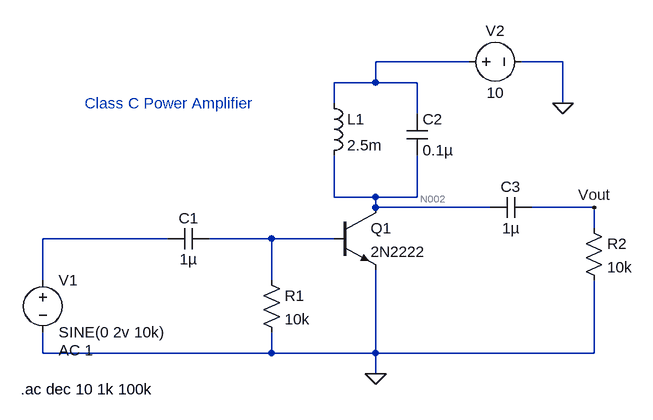
[diagram p0: schematic Experiment 5 - Class C Power Amplifiers.asc]
Experiment 5 - Class C Power Amplifiers.asc, the LTspice schematic file:
Version 4
SHEET 1 964 680
WIRE 704 -208 560 -208
WIRE 848 -208 784 -208
WIRE 560 -176 560 -208
WIRE 560 -176 496 -176
WIRE 624 -176 560 -176
WIRE 496 -144 496 -176
WIRE 848 -144 848 -208
WIRE 624 -128 624 -176
WIRE 496 0 496 -64
WIRE 560 0 496 0
WIRE 624 0 624 -64
WIRE 624 0 560 0
WIRE 560 16 560 0
WIRE 736 16 560 16
WIRE 896 16 800 16
WIRE 896 48 896 16
WIRE 240 64 48 64
WIRE 400 64 304 64
WIRE 496 64 400 64
WIRE 48 128 48 64
WIRE 400 128 400 64
WIRE 48 240 48 208
WIRE 400 240 400 208
WIRE 400 240 48 240
WIRE 560 240 560 112
WIRE 560 240 400 240
WIRE 896 240 896 128
WIRE 896 240 560 240
WIRE 560 272 560 240
FLAG 560 272 0
FLAG 848 -144 0
FLAG 896 16 Vout
SYMBOL voltage 48 112 R0
WINDOW 123 24 124 Left 2
WINDOW 39 0 0 Left 0
SYMATTR InstName V1
SYMATTR Value SINE(0 2v 10k)
SYMATTR Value2 AC 1
SYMBOL cap 304 48 R90
WINDOW 0 0 32 VBottom 2
WINDOW 3 32 32 VTop 2
SYMATTR InstName C1
SYMATTR Value 1µ
SYMBOL res 384 112 R0
SYMATTR InstName R1
SYMATTR Value 10k
SYMBOL npn 496 16 R0
SYMATTR InstName Q1
SYMATTR Value 2N2222
SYMBOL cap 608 -128 R0
SYMATTR InstName C2
SYMATTR Value 0.1µ
SYMBOL ind 480 -160 R0
SYMATTR InstName L1
SYMATTR Value 2.5m
SYMBOL voltage 688 -208 R270
WINDOW 0 32 56 VTop 2
WINDOW 3 -32 56 VBottom 2
WINDOW 123 0 0 Left 0
WINDOW 39 0 0 Left 0
SYMATTR InstName V2
SYMATTR Value 10
SYMBOL cap 800 0 R90
WINDOW 0 0 32 VBottom 2
WINDOW 3 32 32 VTop 2
SYMATTR InstName C3
SYMATTR Value 1µ
SYMBOL res 880 32 R0
SYMATTR InstName R2
SYMATTR Value 10k
TEXT 14 296 Left 2 !.ac dec 10 1k 100k
TEXT 112 -144 Left 2 ;Class C Power Amplifier

The netlist it stands for:
* Experiment 5 - Class C Power Amplifiers.asc
V1 N003 0 SINE(0 2v 10k) AC 1
C1 N004 N003 1µ
R1 N004 0 10k
Q1 N002 N004 0 0 2N2222
C2 N001 N002 0.1µ
L1 N001 N002 2.5m
V2 N001 0 10
C3 Vout N002 1µ
R2 Vout 0 10k
.model NPN NPN
.model PNP PNP
.lib standard.bjt
.ac dec 10 1k 100k
* Class C Power Amplifier
.backanno
.end

* Results of the author's LTspice run, read from the files saved beside the schematic
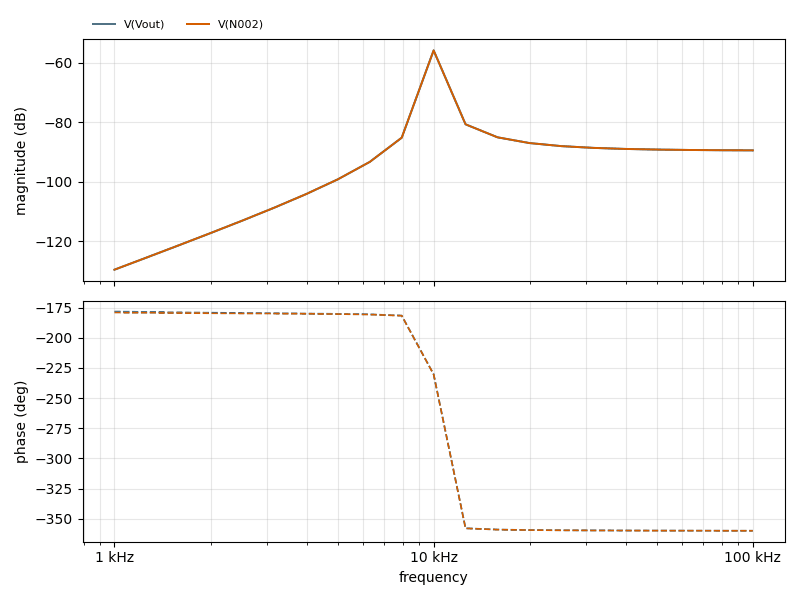
[diagram p1: AC Analysis of Experiment 5 - Class C Power Amplifiers.asc, plotted from the saved traces]
* AC Analysis, 1 run:
*   V(Vout): -129.60 dB at 1 kHz, -89.48 dB at 100 kHz, peak -55.87 dB at 10 kHz, 3 dB below the peak at 9.767 kHz and 10.28 kHz
*   V(N002): -129.60 dB at 1 kHz, -89.48 dB at 100 kHz, peak -55.87 dB at 10 kHz, 3 dB below the peak at 9.767 kHz and 10.28 kHz